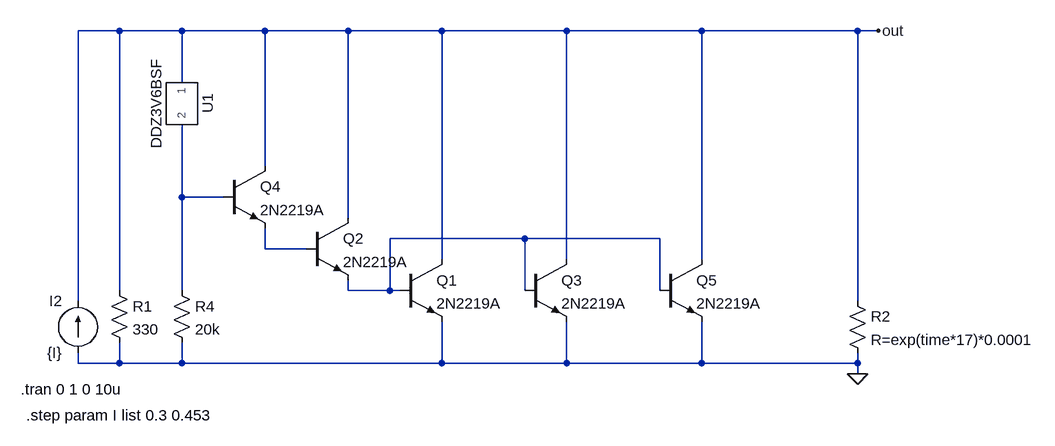
[diagram p0: schematic SolarCell.asc]
SolarCell.asc, the LTspice schematic file:
Version 4
SHEET 1 2248 680
WIRE 160 -288 96 -288
WIRE 256 -288 160 -288
WIRE 384 -288 256 -288
WIRE 512 -288 384 -288
WIRE 656 -288 512 -288
WIRE 848 -288 656 -288
WIRE 1056 -288 848 -288
WIRE 1296 -288 1056 -288
WIRE 1328 -288 1296 -288
WIRE 256 -208 256 -288
WIRE 384 -80 384 -288
WIRE 256 -32 256 -144
WIRE 320 -32 256 -32
WIRE 512 0 512 -288
WIRE 784 32 576 32
WIRE 992 32 784 32
WIRE 384 48 384 16
WIRE 448 48 384 48
WIRE 656 64 656 -288
WIRE 848 64 848 -288
WIRE 1056 64 1056 -288
WIRE 160 112 160 -288
WIRE 256 112 256 -32
WIRE 512 112 512 96
WIRE 576 112 576 32
WIRE 576 112 512 112
WIRE 592 112 576 112
WIRE 784 112 784 32
WIRE 992 112 992 32
WIRE 96 128 96 -288
WIRE 1296 128 1296 -288
WIRE 96 224 96 208
WIRE 160 224 160 192
WIRE 160 224 96 224
WIRE 256 224 256 192
WIRE 256 224 160 224
WIRE 656 224 656 160
WIRE 656 224 256 224
WIRE 848 224 848 160
WIRE 848 224 656 224
WIRE 1056 224 1056 160
WIRE 1056 224 848 224
WIRE 1296 224 1296 208
WIRE 1296 224 1056 224
WIRE 1296 240 1296 224
FLAG 1296 240 0
FLAG 1328 -288 out
SYMBOL res 1280 112 R0
SYMATTR InstName R2
SYMATTR Value R=exp(time*17)*0.0001
SYMBOL res 144 96 R0
SYMATTR InstName R1
SYMATTR Value 330
SYMBOL current 96 208 R180
WINDOW 0 24 80 Left 2
WINDOW 3 24 0 Left 2
WINDOW 123 0 0 Left 0
WINDOW 39 0 0 Left 0
SYMATTR InstName I2
SYMATTR Value {I}
SYMBOL npn 448 0 R0
SYMATTR InstName Q2
SYMATTR Value 2N2219A
SYMBOL res 240 96 R0
SYMATTR InstName R4
SYMATTR Value 20k
SYMBOL npn 592 64 R0
SYMATTR InstName Q1
SYMATTR Value 2N2219A
SYMBOL npn 784 64 R0
SYMATTR InstName Q3
SYMATTR Value 2N2219A
SYMBOL npn 320 -80 R0
SYMATTR InstName Q4
SYMATTR Value 2N2219A
SYMBOL npn 992 64 R0
SYMATTR InstName Q5
SYMATTR Value 2N2219A
SYMBOL DDZ3V6BSF 256 -176 R90
SYMATTR InstName U1
TEXT 8 264 Left 2 !.tran 0 1 0 10u
TEXT 16 304 Left 2 !.step param I list 0.3 0.453

The netlist it stands for:
* SolarCell.asc
R2 out 0 R=exp(time*17)*0.0001
R1 out 0 330
I2 0 out {I}
Q2 out N003 N002 0 2N2219A
R4 N001 0 20k
Q1 out N002 0 0 2N2219A
Q3 out N002 0 0 2N2219A
Q4 out N001 N003 0 2N2219A
Q5 out N002 0 0 2N2219A
XU1 out N001 DDZ3V6BSF  ; pins 1 2
.model NPN NPN
.model PNP PNP
.lib standard.bjt
.tran 0 1 0 10u
.step param I list 0.3 0.453
.lib DDZ3V6BSF.txt
.backanno
.end